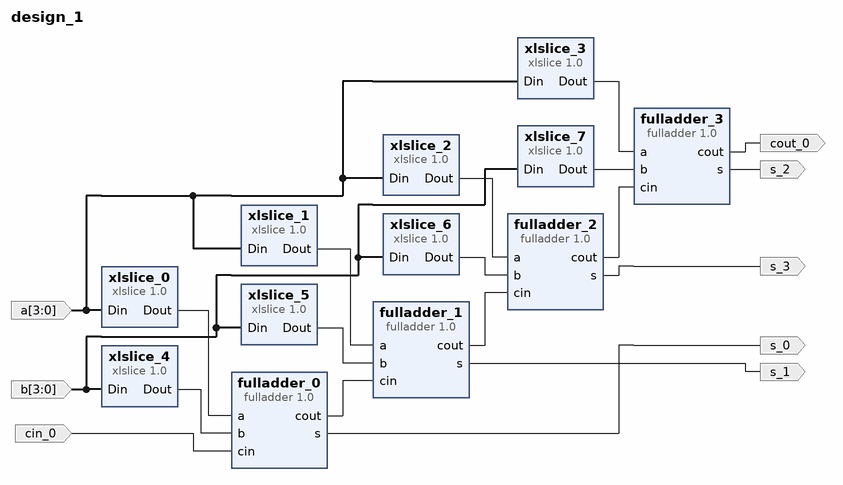
[diagram p0: block diagram of the top level]
# Vivado block design design_1, xc7a35tftg256-1, Vivado 2024.2
create_bd_design design_1

create_bd_port -dir I -from 3 -to 0 a
create_bd_port -dir I -from 3 -to 0 b
create_bd_port -dir O s_0
create_bd_port -dir O s_1
create_bd_port -dir O s_2
create_bd_port -dir O s_3
create_bd_port -dir O cout_0
create_bd_port -dir I cin_0

create_bd_cell -type ip -vlnv xilinx.com:user:fulladder:1.0 fulladder_0
create_bd_cell -type ip -vlnv xilinx.com:user:fulladder:1.0 fulladder_1
create_bd_cell -type ip -vlnv xilinx.com:user:fulladder:1.0 fulladder_2
create_bd_cell -type ip -vlnv xilinx.com:user:fulladder:1.0 fulladder_3
create_bd_cell -type ip -vlnv xilinx.com:ip:xlslice:1.0 xlslice_0
set_property -dict {CONFIG.DIN_WIDTH 4} [get_bd_cells xlslice_0]
create_bd_cell -type ip -vlnv xilinx.com:ip:xlslice:1.0 xlslice_1
set_property -dict {CONFIG.DIN_FROM 1 CONFIG.DIN_TO 1 CONFIG.DIN_WIDTH 4} [get_bd_cells xlslice_1]
create_bd_cell -type ip -vlnv xilinx.com:ip:xlslice:1.0 xlslice_2
set_property -dict {CONFIG.DIN_FROM 2 CONFIG.DIN_TO 2 CONFIG.DIN_WIDTH 4} [get_bd_cells xlslice_2]
create_bd_cell -type ip -vlnv xilinx.com:ip:xlslice:1.0 xlslice_3
set_property -dict {CONFIG.DIN_FROM 3 CONFIG.DIN_TO 3 CONFIG.DIN_WIDTH 4} [get_bd_cells xlslice_3]
create_bd_cell -type ip -vlnv xilinx.com:ip:xlslice:1.0 xlslice_4
set_property -dict {CONFIG.DIN_WIDTH 4} [get_bd_cells xlslice_4]
create_bd_cell -type ip -vlnv xilinx.com:ip:xlslice:1.0 xlslice_5
set_property -dict {CONFIG.DIN_FROM 1 CONFIG.DIN_TO 1 CONFIG.DIN_WIDTH 4} [get_bd_cells xlslice_5]
create_bd_cell -type ip -vlnv xilinx.com:ip:xlslice:1.0 xlslice_6
set_property -dict {CONFIG.DIN_FROM 2 CONFIG.DIN_TO 2 CONFIG.DIN_WIDTH 4} [get_bd_cells xlslice_6]
create_bd_cell -type ip -vlnv xilinx.com:ip:xlslice:1.0 xlslice_7
set_property -dict {CONFIG.DIN_FROM 3 CONFIG.DIN_TO 3 CONFIG.DIN_WIDTH 4} [get_bd_cells xlslice_7]

# ---- connections ----

connect_bd_net [get_bd_ports a] [get_bd_pins xlslice_0/Din] [get_bd_pins xlslice_1/Din] [get_bd_pins xlslice_2/Din] [get_bd_pins xlslice_3/Din]
connect_bd_net [get_bd_ports b] [get_bd_pins xlslice_4/Din] [get_bd_pins xlslice_5/Din] [get_bd_pins xlslice_7/Din] [get_bd_pins xlslice_6/Din]
connect_bd_net -net cin_0_1 [get_bd_ports cin_0] [get_bd_pins fulladder_0/cin]
connect_bd_net [get_bd_pins fulladder_0/cout] [get_bd_pins fulladder_1/cin]
connect_bd_net [get_bd_pins fulladder_0/s] [get_bd_ports s_0]
connect_bd_net [get_bd_pins fulladder_1/cout] [get_bd_pins fulladder_2/cin]
connect_bd_net [get_bd_pins fulladder_1/s] [get_bd_ports s_1]
connect_bd_net [get_bd_pins fulladder_2/cout] [get_bd_pins fulladder_3/cin]
connect_bd_net [get_bd_pins fulladder_2/s] [get_bd_ports s_3]
connect_bd_net [get_bd_pins fulladder_3/cout] [get_bd_ports cout_0]
connect_bd_net [get_bd_pins fulladder_3/s] [get_bd_ports s_2]
connect_bd_net [get_bd_pins xlslice_0/Dout] [get_bd_pins fulladder_0/a]
connect_bd_net [get_bd_pins xlslice_1/Dout] [get_bd_pins fulladder_1/a]
connect_bd_net [get_bd_pins xlslice_2/Dout] [get_bd_pins fulladder_2/a]
connect_bd_net [get_bd_pins xlslice_3/Dout] [get_bd_pins fulladder_3/a]
connect_bd_net [get_bd_pins xlslice_4/Dout] [get_bd_pins fulladder_0/b]
connect_bd_net [get_bd_pins xlslice_5/Dout] [get_bd_pins fulladder_1/b]
connect_bd_net [get_bd_pins xlslice_6/Dout] [get_bd_pins fulladder_2/b]
connect_bd_net [get_bd_pins xlslice_7/Dout] [get_bd_pins fulladder_3/b]

validate_bd_design
save_bd_design
